# Altium schematic sheet uPre.SchDoc
size A
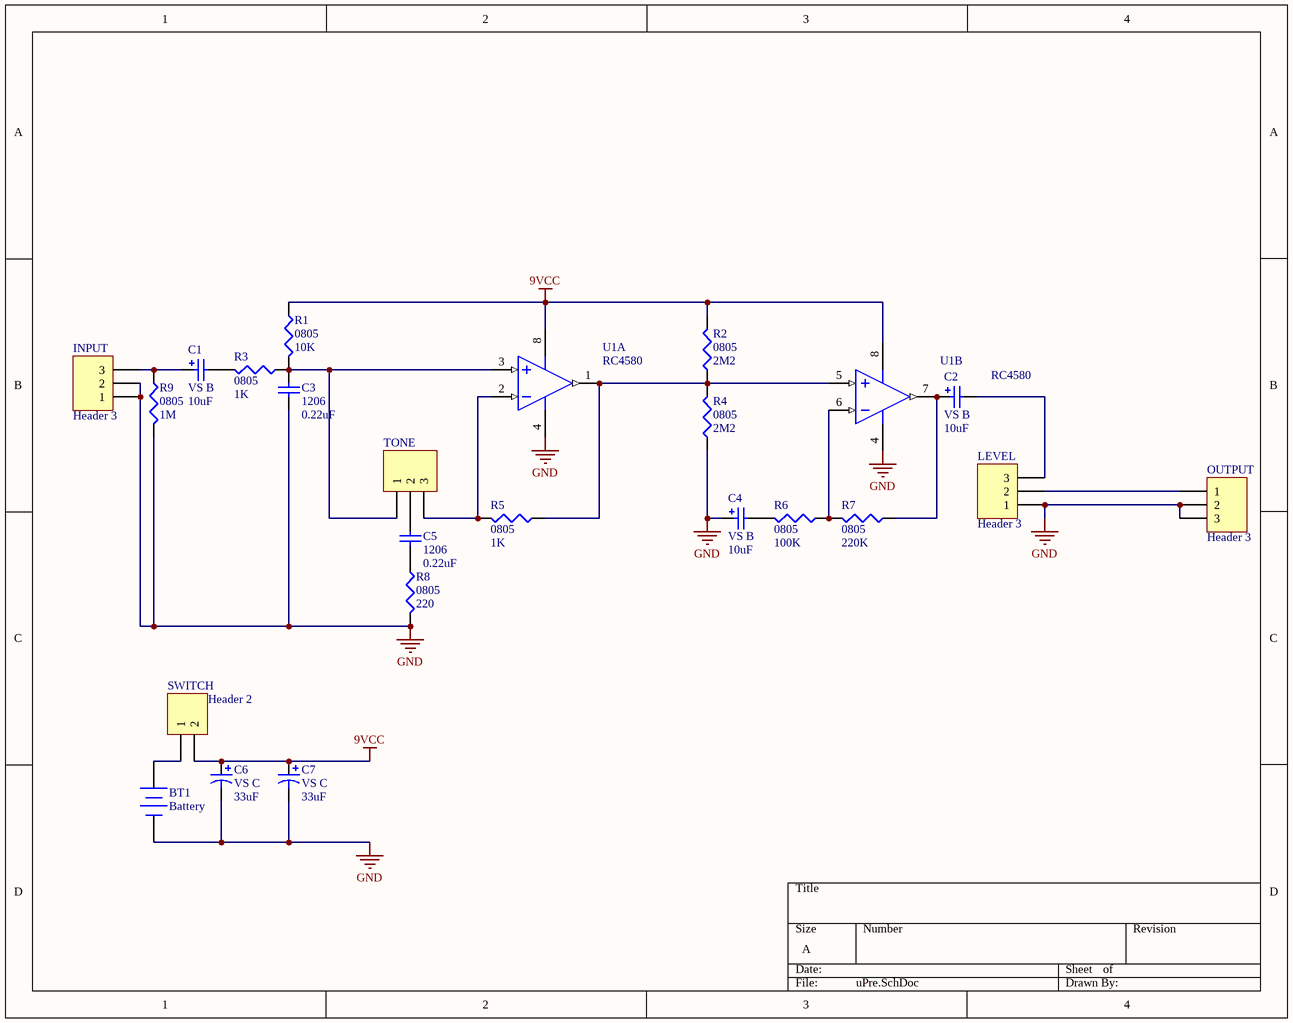
[diagram p0: uPre.SchDoc]

## Parts
BT1  Battery  [BAT-2]
C1  VS B  value 10uF  [Panasonic VS B]
C2  VS B  value 10uF  [Panasonic VS B]
C3  1206  value 0.22uF  [C1206]
C4  VS B  value 10uF  [Panasonic VS B]
C5  1206  value 0.22uF  [C1206]
C6  VS C  value 33uF  [Panasonic VS C]
C7  VS C  value 33uF  [Panasonic VS C]
INPUT  Header 3  [HDR1X3]
LEVEL  Header 3  [HDR1X3]
OUTPUT  Header 3  [HDR1X3]
R1  0805  value 10K  [SM 0805 - gap trimmed]
R2  0805  value 2M2  [SM 0805 - gap trimmed]
R3  0805  value 1K  [SM 0805 - gap trimmed]
R4  0805  value 2M2  [SM 0805 - gap trimmed]
R5  0805  value 1K  [SM 0805 - gap trimmed]
R6  0805  value 100K  [SM 0805 - gap trimmed]
R7  0805  value 220K  [SM 0805 - gap trimmed]
R8  0805  value 220  [SM 0805 - gap trimmed]
R9  0805  value 1M  [SM 0805 - gap trimmed]
SWITCH  Header 2  [HDR1X2]
TONE  TONE  [HDR1X3]  (value not drawn)
U1  RC4580  [SOIC127P600X175-8N]  (parts A,B of 2)

## Nets
9VCC: C6.1 C7.1 R1.1 R2.2 SWITCH.2 U1.8(V+)
GND: BT1.2(-) C3.1 C4.1 C6.2 C7.2 INPUT.1 INPUT.2 LEVEL.1 OUTPUT.2 OUTPUT.3 R4.1 R8.2 R9.2 U1.4(V-)
NetBT1_1: BT1.1(+) SWITCH.1
NetC1_1: C1.1 INPUT.3 R9.1
NetC1_2: C1.2 R3.2
NetC2_1: C2.1 R7.1 U1.7(OUT_B)
NetC2_2: C2.2 LEVEL.3
NetC3_2: C3.2 R1.2 R3.1 TONE.1 U1.3(IN_A)
NetC4_2: C4.2 R6.2
NetC5_1: C5.1 R8.1
NetC5_2: C5.2 TONE.2
NetLEVEL_2: LEVEL.2 OUTPUT.1
NetR2_1: R2.1 R4.2 R5.1 U1.1(OUT_A) U1.5(IN_B)
NetR5_2: R5.2 TONE.3 U1.2(IN_A)
NetR6_1: R6.1 R7.2 U1.6(IN_B)

## Library data of the parts
BT1 = Battery: Multicell Battery; Published: 24-Mar-1999; LatestRevisionDate: 17-Jul-2002; LatestRevisionNote: Re-released for DXP Platform.; PackageReference: BAT-2; Publisher: Altium Limited; PackageDescription: Battery; 2 Leads
C1 C2 C4 = Cap Pol2: Polarized Capacitor (Axial); Published: 8-Jun-2000; LatestRevisionDate: 17-Jul-2002; LatestRevisionNote: Re-released for DXP Platform.; PackageReference: POLAR0.8; Publisher: Altium Limited; PackageDescription: Polarized Capacitor; 2 Leads
C3 C5 = Cap Semi: Capacitor (Semiconductor SIM Model); Published: 8-Jun-2000; LatestRevisionDate: 29-May-2009; LatestRevisionNote: IPC-7351 Footprint Added.; PackageReference: C1206; Publisher: Altium Limited; PackageDescription: Chip Capacitor
C6 C7 = Cap Pol1: Polarized Capacitor (Radial); Published: 8-Jun-2000; LatestRevisionDate: 17-Jul-2002; LatestRevisionNote: Re-released for DXP Platform.; PackageReference: RB7.6-15; Publisher: Altium Limited; PackageDescription: Polarized Capacitor (Radial); 2 Leads
INPUT LEVEL OUTPUT TONE = Header 3: Header, 3-Pin; LatestRevisionDate: 17-Jul-2002; LatestRevisionNote: Re-released for DXP Platform.; Publisher: Altium Limited
R1-R9 = Res3: Resistor; Published: 8-Jun-2000; LatestRevisionDate: 29-May-2009; LatestRevisionNote: IPC-7351 Footprint Added.; PackageReference: J1-0603; Publisher: Altium Limited; PackageDescription: Chip Resistor
SWITCH = Header 2: Header, 2-Pin; LatestRevisionDate: 17-Jul-2002; LatestRevisionNote: Re-released for DXP Platform.; Publisher: Altium Limited
U1 = RC4580: Low Noise, High Performance, High Fidelity Dual Audio Operational Amplifier, 8-pin Narrow SOIC; PartNumber: LME49722MA; Manufacturer: National Semiconductor; PackageTopMarking: NSZXTT*L49722*MA; PowerWise: N; CompType: Audio IC; High-Reliability: Y; DatasheetVersion: Mar-2008; PackageVersion: revM, May-2009; PackageReference: M08A; PackageDescription: SOIC Narrow, 4.9 x 3.9 x 1.45mm, 8 Lead, 1.27mm Pitch; RoHS: Y; PinCount: 8; Code_JEDEC: MS-012-AA; Code_IPC: SOIC127P600-8; ComponentLink1Description: Manufacturer URL; ComponentLink1URL: http://www.national.com/; ComponentLink2Description: LME49722 Datasheet; ComponentLink2URL: http://www.national.com/ds/LM/LME49722.pdf; ComponentLink3Description: LME49722 Web Page; ComponentLink3URL: http://www.national.com/pf/LM/LME49722.html; ComponentLink4Description: M08A Package Page; ComponentLink4URL: http://www.national.com/packaging/folders/m08a.html